# EAGLE design V-00684-00 (EAGLE 7.2.0)
AUTHOR: M. Petrilak; VERSION: 01

## Sheet 1 of 2
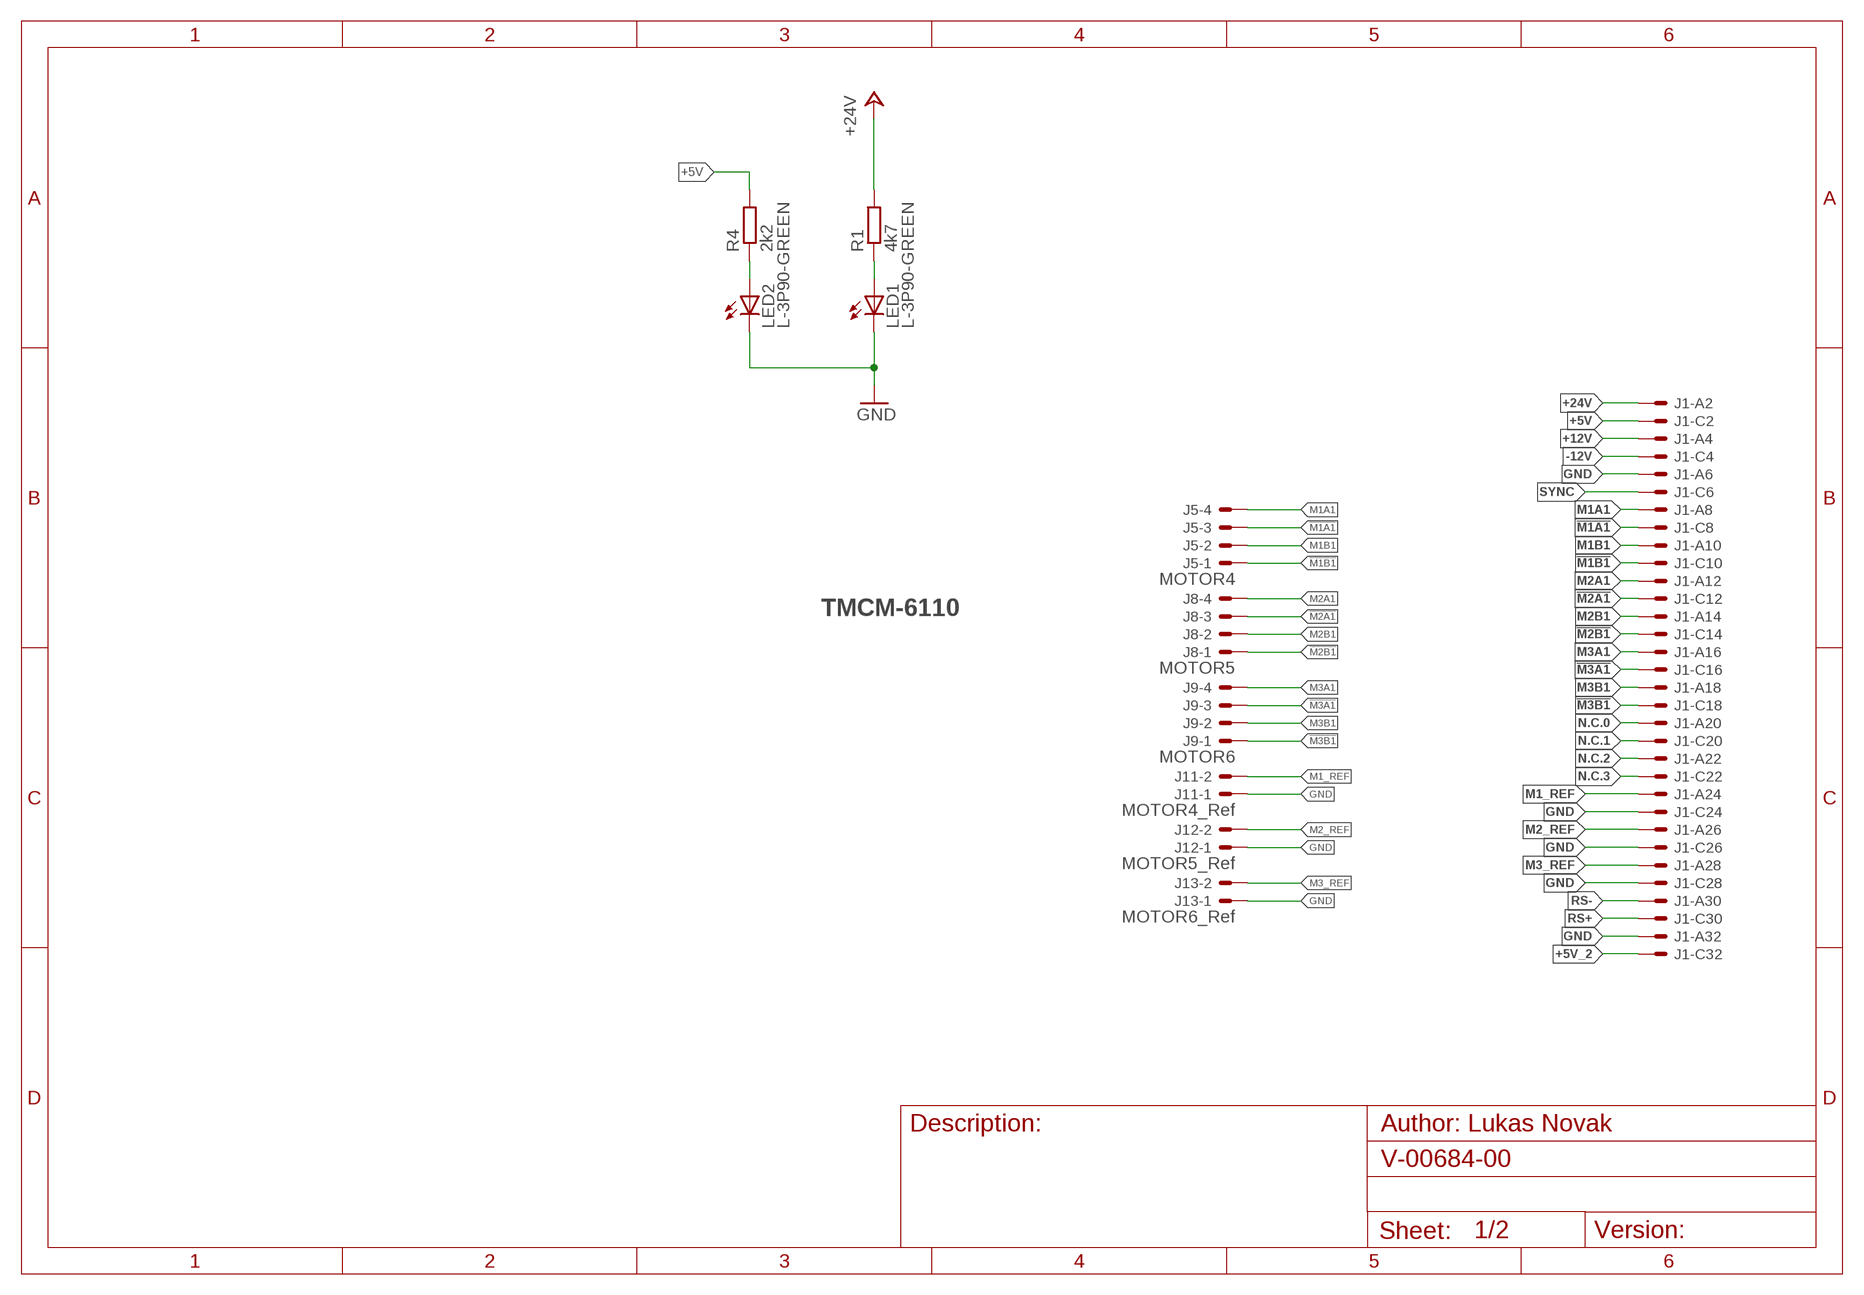
[diagram p0: schematic, sheet 1]

### Parts
J1  VG32SP  [VG32P]
J5  MOTOR4  22-05-7048-04  [7395-04]
J8  MOTOR5  22-05-7048-04  [7395-04]
J9  MOTOR6  22-05-7048-04  [7395-04]
J11  MOTOR4_Ref  22-05-7028-02  [7395-02]
J12  MOTOR5_Ref  22-05-7028-02  [7395-02]
J13  MOTOR6_Ref  22-05-7028-02  [7395-02]
LED1  L-3P90-GREEN  [L-3P90]
LED2  L-3P90-GREEN  [L-3P90]
R1  4k7  R-EU_R1206  [R1206]
R4  2k2  R-EU_R1206  [R1206]

### Nets
!M1A1: J1.C8 J5.3
!M1B1: J1.C10 J5.1
!M2A1: J1.C12 J8.3
!M2B1: J1.C14 J8.1
!M3A1: J1.C16 J9.3
!M3B1: J1.C18 J9.1
+5V: J1.C2 R4.2
+5V_2: J1.C32
+12V: J1.A4
+24V: J1.A2 R1.2
-12V: J1.C4
GND: J1.A6 J1.A32 J1.C24 J1.C26 J1.C28 J11.1 J12.1 J13.1 LED1.K(C) LED2.K(C)
M1_REF: J1.A24 J11.2
M1A1: J1.A8 J5.4
M1B1: J1.A10 J5.2
M2_REF: J1.A26 J12.2
M2A1: J1.A12 J8.4
M2B1: J1.A14 J8.2
M3_REF: J1.A28 J13.2
M3A1: J1.A16 J9.4
M3B1: J1.A18 J9.2
N$3: LED1.A R1.1
N$6: LED2.A R4.1
N.C.0: J1.A20
N.C.1: J1.C20
N.C.2: J1.A22
N.C.3: J1.C22
RS+: J1.C30
RS-: J1.A30
SYNC: J1.C6

### Notes on the sheet
- TMCM-6110

## Sheet 2 of 2

## Library data of the parts
J1 = 19inch:VG32S: PCB EUROCARD, 32-pin type C/AC, 5.08 mm
J5 J8 J9 = con-molex:22-?-04: CONNECTOR wire to board 2.54 mm (.1 inch) pitch header; OC_FARNELL: unknown; OC_NEWARK: unknown
J11-J13 = con-molex:22-?-02: CONNECTOR wire to board 2.54 mm (.1 inch) pitch header; OC_FARNELL: 9731601; OC_NEWARK: unknown
LED1 LED2 = led:L-3P90
R1 R4 = rcl:R-EU_: RESISTOR, European symbol

## Board
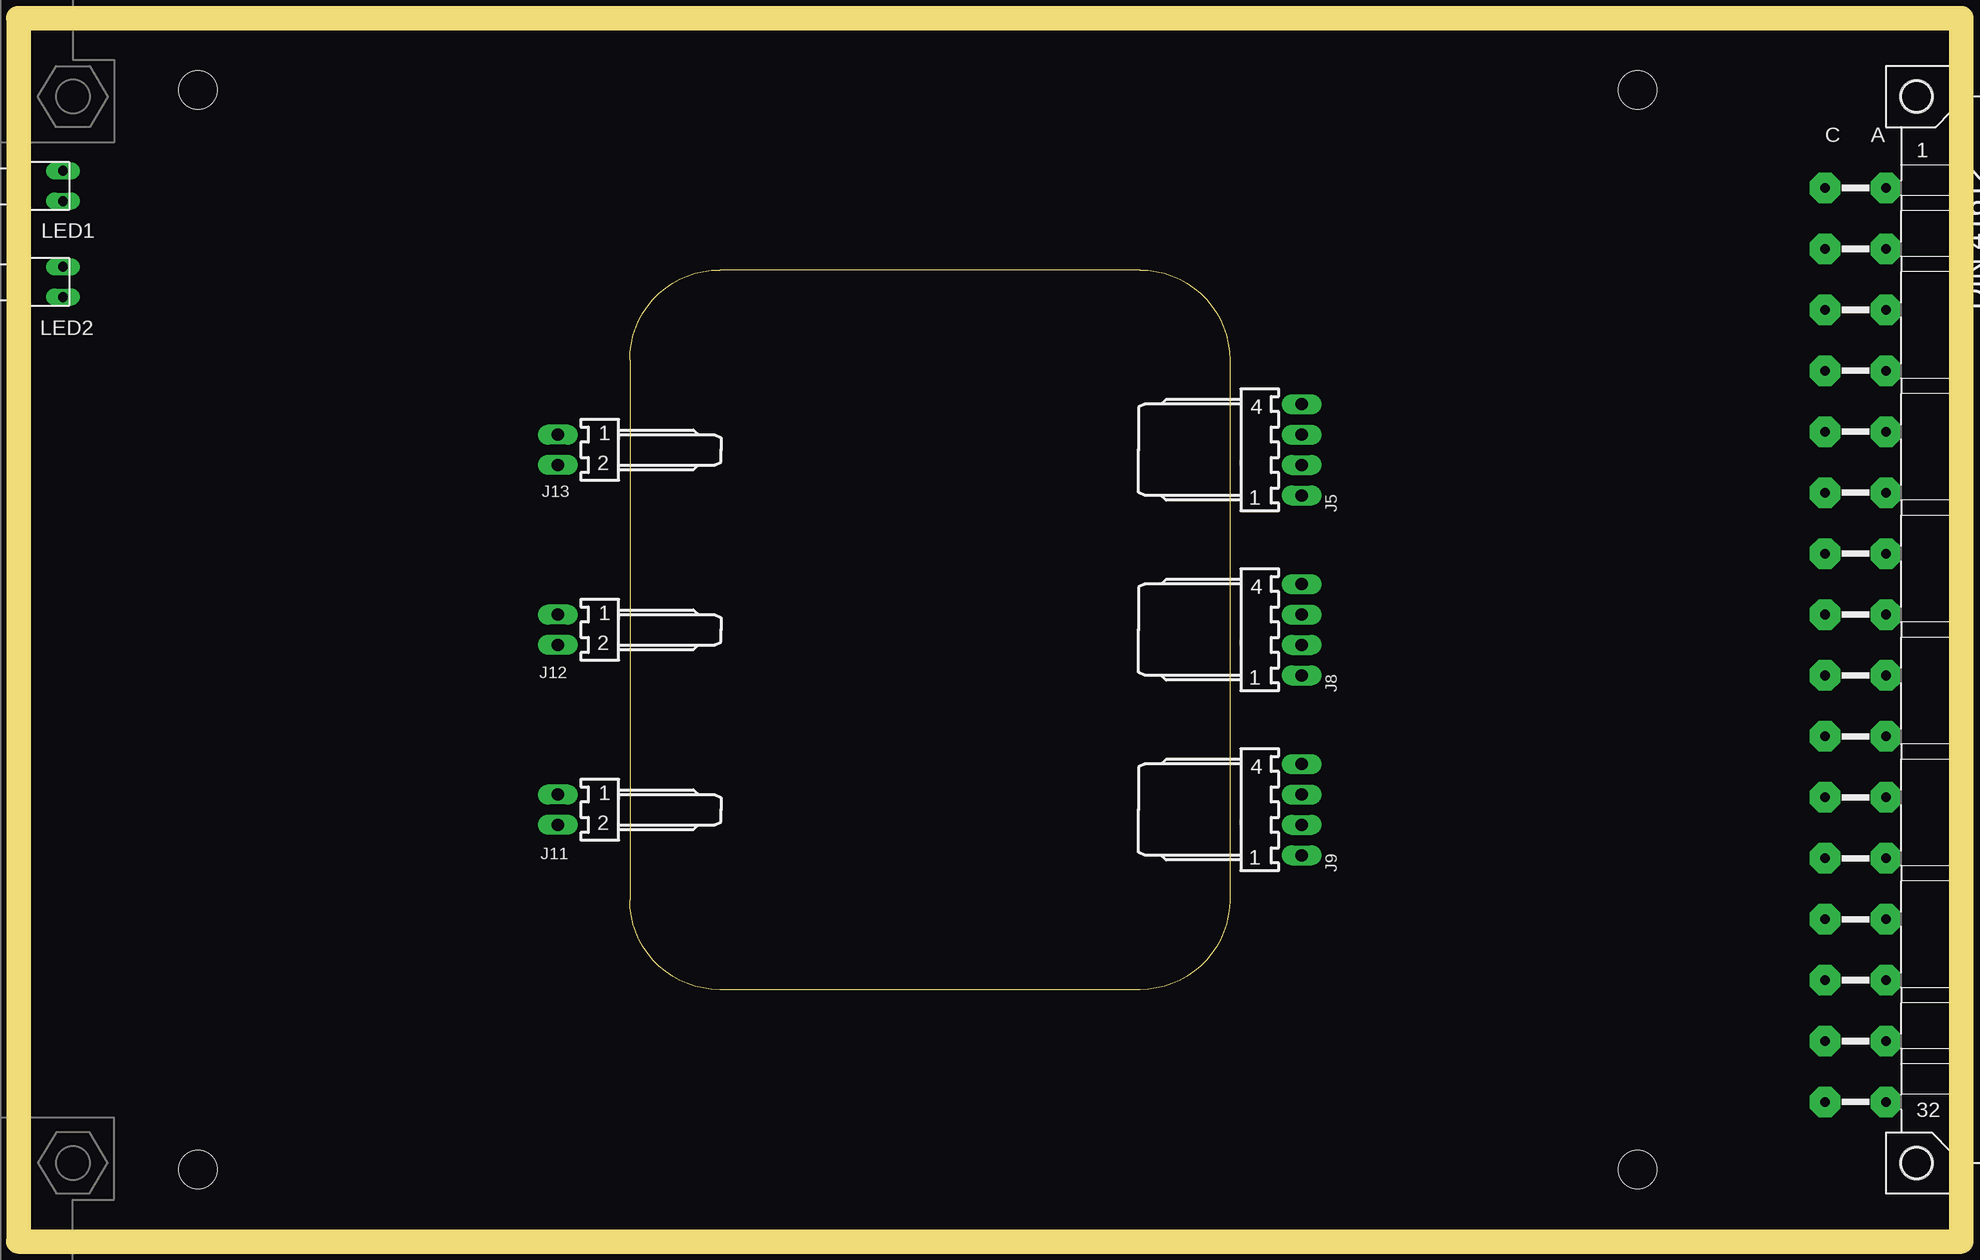
[diagram p1: board, top side]
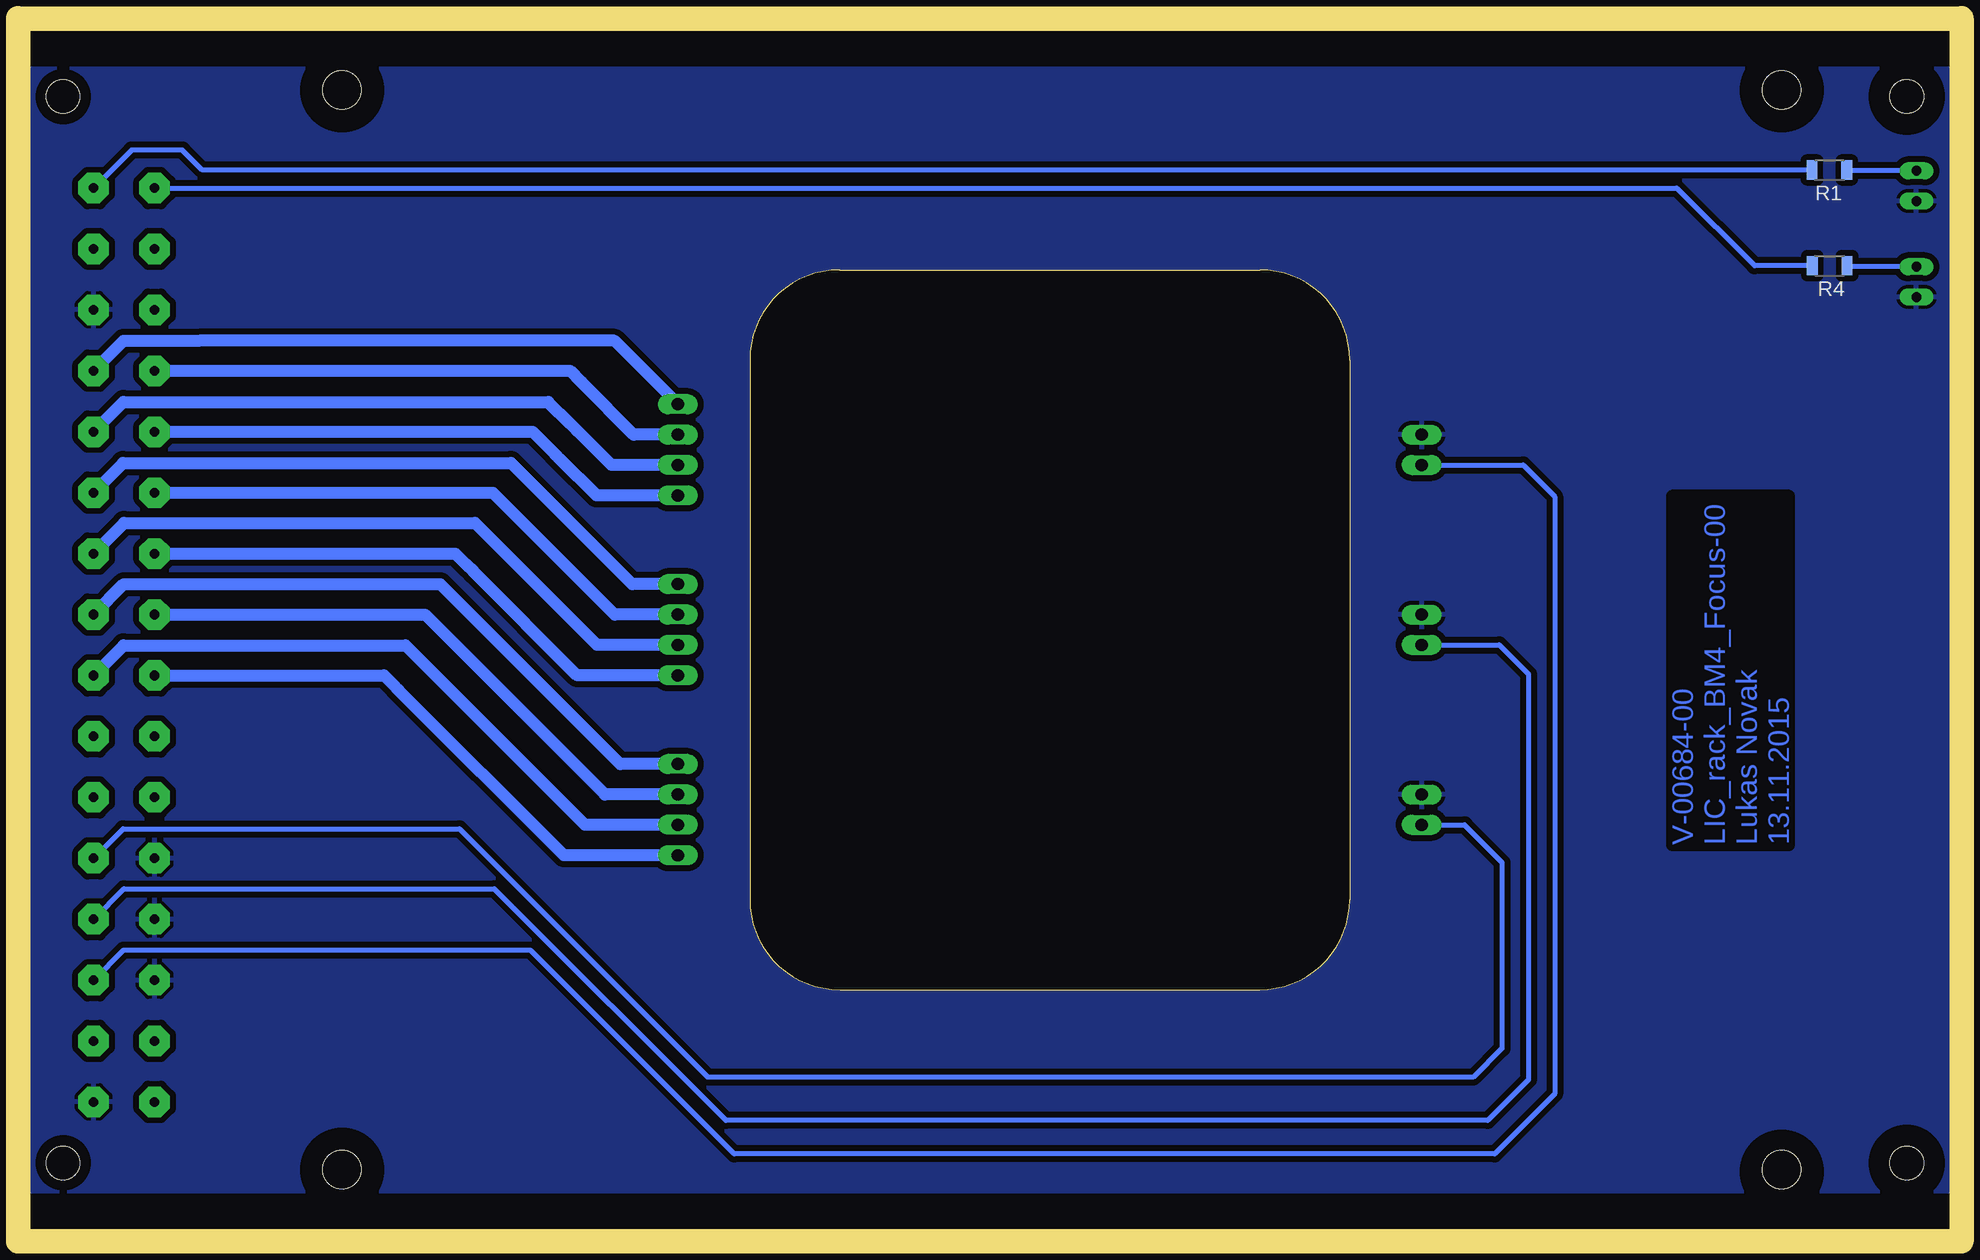
[diagram p2: board, bottom side, seen from below]

Size 160 x 100 mm. Coordinates in mm from the lower left corner, seen from the top.
Outline: 50,72.5 50,27.5 arc90 57.5,20 92.5,20 arc90 100,27.5 100,72.5 arc90 92.5,80 57.5,80 arc90 50,72.5
Copper layers (1*16): Top 0.04mm / dielectric 1.5mm / Bottom 0.04mm
Design rules "Michal_mid *": minimum track width 0.2mm, minimum drill 0.6mm, track to track 0.5mm, track to pad 0.5mm, pad to pad 0.3mm, via to via 0.3mm, smd to smd 0mil, copper to edge 0.0001mm, drill to drill 0.2mm, minimum pad ring 0.3mm, minimum via ring 0.3mm, stop-mask expansion 0.1mm, vias tented up to drill 0.5mm, thermal gap 0.3mm
Holes 3.2 mm at 14,95 14,5 134,95 134,5
bRestrict: area 10.5,91.5 to 17.5,98.5; area 130.5,91.5 to 137.5,98.5; area 10.5,1.3 to 17.5,8.3; area 130.5,1.5 to 137.5,8.5

### Footprints (pad centres in the part's own frame; a part is rotated, then mirrored left to right if it is on the bottom)
VG32P = drill 0.8 pad 2.54 octagon: A2 154.7,36.83; A4 154.7,31.75; A6 154.7,26.67; A8 154.7,21.59; A10 154.7,16.51; A12 154.7,11.43; A14 154.7,6.35; A16 154.7,1.27; A18 154.7,-3.81; A20 154.7,-8.89; A22 154.7,-13.97; A24 154.7,-19.05; A26 154.7,-24.13; A28 154.7,-29.21; A30 154.7,-34.29; A32 154.7,-39.37; C2 149.62,36.83; C4 149.62,31.75; C6 149.62,26.67; C8 149.62,21.59; C10 149.62,16.51; C12 149.62,11.43; C14 149.62,6.35; C16 149.62,1.27; C18 149.62,-3.81; C20 149.62,-8.89; C22 149.62,-13.97; C24 149.62,-19.05; C26 149.62,-24.13; C28 149.62,-29.21; C30 149.62,-34.29; C32 149.62,-39.37 | hole 2.794: 3.57,44.45; 3.57,-44.45; 157.24,44.45; 157.24,-44.45
7395-04 = drill 1.016 long: 1 3.81,0; 2 1.27,0; 3 -1.27,0; 4 -3.81,0
7395-02 = drill 1.016 long: 1 1.27,0; 2 -1.27,0
L-3P90 = drill 0.813 long: A 4.7,1.27; K 4.7,-1.27
R1206 = smd 0.9 x 1.6: 1 -1.45,0; 2 1.45,0

### Placement (x,y rotation side)
J1  0,50 0 top
J5  106,65 270 top
J8  106,50 270 top
J9  106,35 270 top
J11  44,35 90 top
J12  44,50 90 top
J13  44,65 90 top
LED1  -1.94,87 0 top
LED2  -1.94,79 0 top
R1  10.01,88.33 180 bottom
R4  9.99,80.35 180 bottom

### Tracks (layer width: path | path; a pad name or v marks a point on that pad's centre or on a via)
!M1A1
  Bottom 1.016: J5.3 109.67,66.27 113.95,70.55 114.1,70.7 114.99,71.59 J1.C8
!M1B1
  Bottom 1.016: J5.1 112.79,61.19 115.8,64.2 116.2,64.6 118.11,66.51 J1.C10
!M2A1
  Bottom 1.016: J8.3 111.27,51.27 119.45,59.45 120.1,60.1 121.43,61.43 J1.C12
!M2B1
  Bottom 1.016: J8.1 114.39,46.19 123,54.8 123.7,55.5 124.55,56.35 J1.C14
!M3A1
  Bottom 1.016: J9.3 112.07,36.27 127.07,51.27 J1.C16
!M3B1
  Bottom 1.016: J9.1 115.49,31.19 129.3,45 129.7,45.4 130.49,46.19 J1.C18
+5V
  Bottom 0.406: J1.C2 22.73,86.83 16.25,80.35 R4.2
+24V
  Bottom 0.406: R1.2 145.63,88.33 147.3,90 151.53,90 J1.A2
GND
  pour Bottom: 0,0 160,0 160,100 0,100
M1_REF
  Bottom 0.406: J11.2 40.43,33.73 37.3,30.6 37.3,15.1 39.7,12.7 103.5,12.7 124.2,33.4 152.25,33.4 J1.A24
M1A1
  Bottom 1.016: J1.A8 152.19,74.1 146.7,74.1 145.9,74.1 111.29,74.1 J5.4
M1B1
  Bottom 1.016: J1.A10 152.21,69 116.8,69 115,67.2 114.4,66.6 111.53,63.73 J5.2
M2_REF
  Bottom 0.406: J12.2 37.53,48.73 35.1,46.3 35.1,12.5 38.5,9.1 102,9.1 121.3,28.4 152.17,28.4 J1.A26
M2A1
  Bottom 1.016: J1.A12 152.23,63.9 119.9,63.9 118,62 117.3,61.3 109.81,53.81 J8.4
M2B1
  Bottom 1.016: J1.A14 152.15,58.9 122.9,58.9 121.7,57.7 121.15,57.15 112.73,48.73 J8.2
M3_REF
  Bottom 0.406: J13.2 35.53,63.73 32.9,61.1 32.9,11.3 37.9,6.3 101.3,6.3 104.8,9.8 105,10 118.3,23.3 152.19,23.3 J1.A28
M3A1
  Bottom 1.016: J1.A16 152.17,53.8 125.8,53.8 124.9,52.9 124.35,52.35 110.81,38.81 J9.4
M3B1
  Bottom 1.016: J1.A18 152.19,48.7 128.7,48.7 128.4,48.4 128.2,48.2 113.73,33.73 J9.2
N$3
  Bottom 0.406: LED1.A 8.5,88.27 R1.1
N$6
  Bottom 0.406: LED2.A 8.46,80.27 R4.1
N.C.3
  Bottom 1: 149.15,35.56 J1.C22

### Text on the board
Bottom: V-00684-00 / LIC_rack_BM4_Focus-00 / Lukas Novak / 13.11.2015